# EAGLE design 226_grideye (EAGLE 8.2.2)
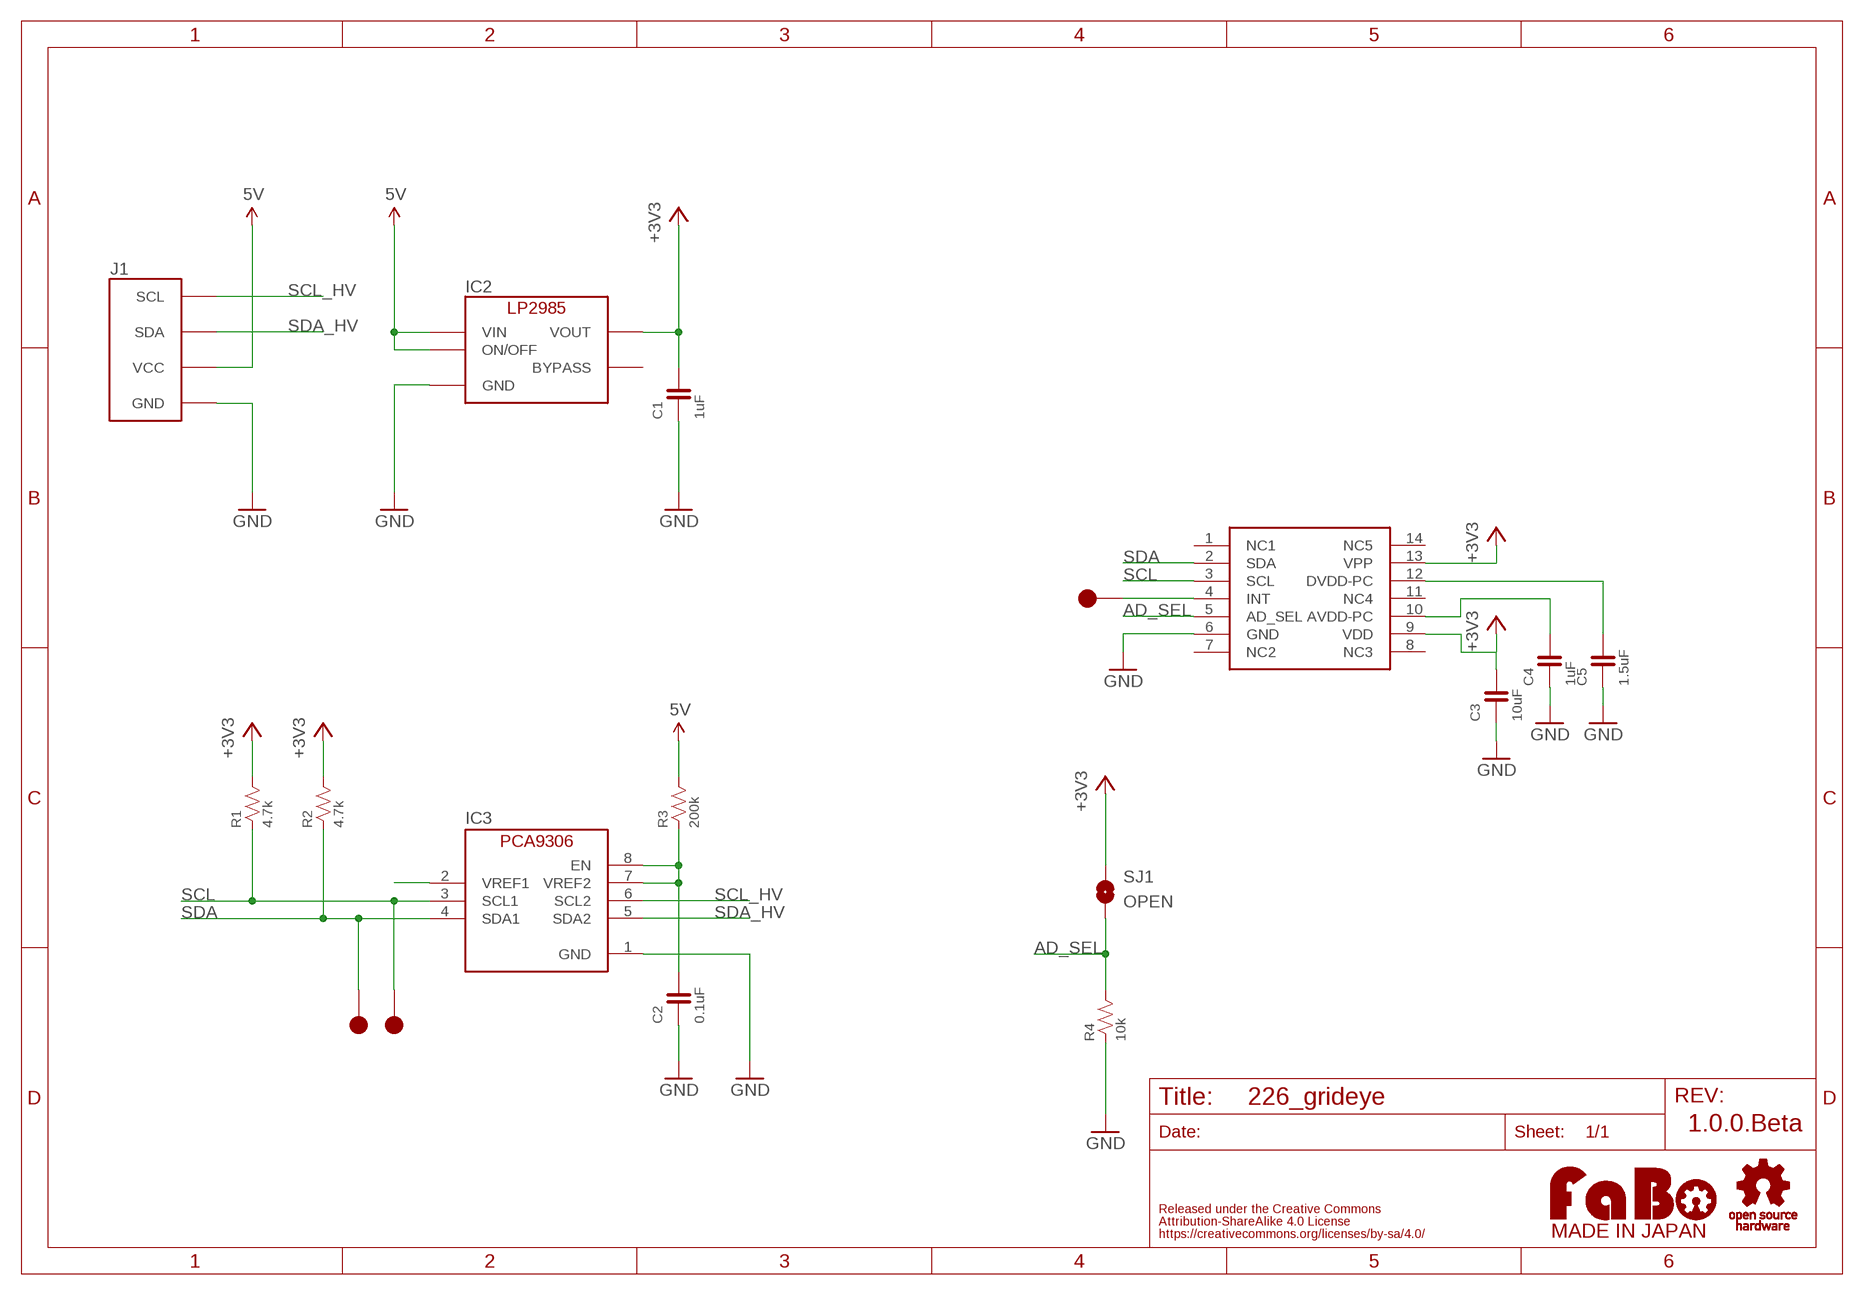
[diagram p0: schematic, sheet 1]

## Parts
C1  1uF  CAPACITOR-0603  [0603]
C2  0.1uF  CAPACITOR-0603  [0603]
C3  10uF  CAPACITOR-0603  [0603]
C4  1uF  CAPACITOR-0603  [0603]
C5  1.5uF  CAPACITOR-0603  [0603]
GRIDEYE  PN-AMG8331  [PANASONIC-AMG8831]
IC2  LP2985-33DBV  [SOT-23-5]
IC3  PCA9306GM  [XQFN8]
INT  INT  TP-15  [TP-15]
J1  FABO_BRICK_I2C  [FABO_BRICK_I2C]
R1  4.7k  RESISTOR-0603  [0603]
R2  4.7k  RESISTOR-0603  [0603]
R3  200k  RESISTOR-0603  [0603]
R4  10k  RESISTOR-0603  [0603]
SJ1  OPEN  SMD-JUMPER-2-OPEN  [SMD-JUMPER-2-OPEN]
TP1  TP-15  [TP-15]
TP2  TP-15  [TP-15]
U$2  LOGO_OSHW-M_BOTTOM  [LOGO_OSHW_M_BOTTOM]
U$3  LOGO_FABO-M  [LOGO_FABO_MS]

## Nets
5V: IC2.1(VIN) IC2.3(ON/OFF) J1.VCC R3.2
+3V3: C1.2 C3.2 GRIDEYE.9(VDD) GRIDEYE.13(VPP) IC2.5(VOUT) R1.2 R2.2 SJ1.1
AD_SEL: GRIDEYE.5(AD_SEL) R4.2 SJ1.2
GND: C1.1 C2.1 C3.1 C4.1 C5.1 GRIDEYE.6(GND) IC2.2(GND) IC3.1(GND) J1.GND R4.1
N$1: C2.2 IC3.7(VREF2) IC3.8(EN) R3.1
N$2: GRIDEYE.4(INT) INT.1
N$3: IC3.2(VREF1)
N$5: C5.2 GRIDEYE.12(DVDD-PC)
N$6: C4.2 GRIDEYE.10(AVDD-PC)
SCL: GRIDEYE.3(SCL) IC3.3(SCL1) R1.1 TP2.1
SCL_HV: IC3.6(SCL2) J1.SCL
SDA: GRIDEYE.2(SDA) IC3.4(SDA1) R2.1 TP1.1
SDA_HV: IC3.5(SDA2) J1.SDA
Unconnected: GRIDEYE.1(NC1) GRIDEYE.7(NC2) GRIDEYE.8(NC3) GRIDEYE.11(NC4) GRIDEYE.14(NC5) IC2.4(BYPASS)

## Notes on the sheet
- 1.0.0.Beta

## Library data of the parts
C1-C5 = FaBo-Capacitor:CAPACITOR: CAPACITOR
GRIDEYE = FaBo-Mems:PN-AMG8331
IC2 = FaBo-Supply:LP2985: LP2985
IC3 = FaBo-LevelTranslator:PCA9306
INT TP1 TP2 = FaBo-Supply:TP
J1 = FaBo-Template:FABO_BRICK_I2C: FaBo Brick I2C
R1-R4 = FaBo-Resistors:RESISTOR: RESISTOR
SJ1 = FaBo-Supply:SMD-JUMPER-2
U$2 = FaBo-etc:LOGO_OSHW
U$3 = FaBo-etc:LOGO_FABO

## Board
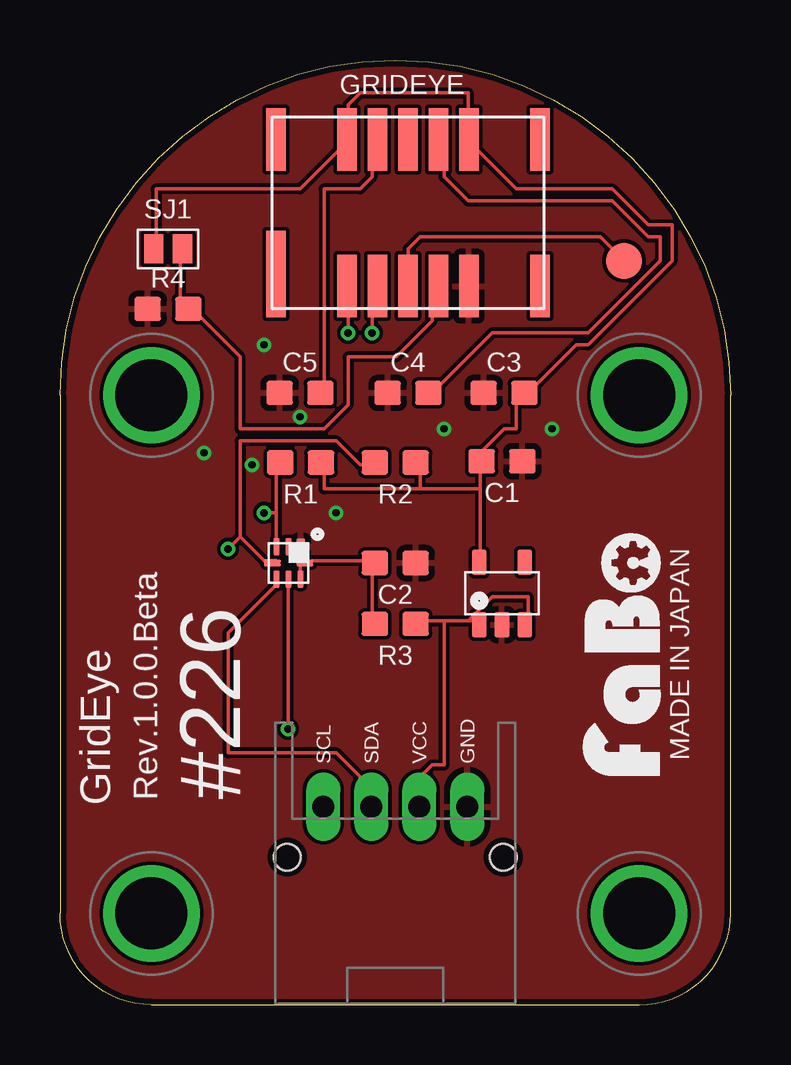
[diagram p1: board, top side]
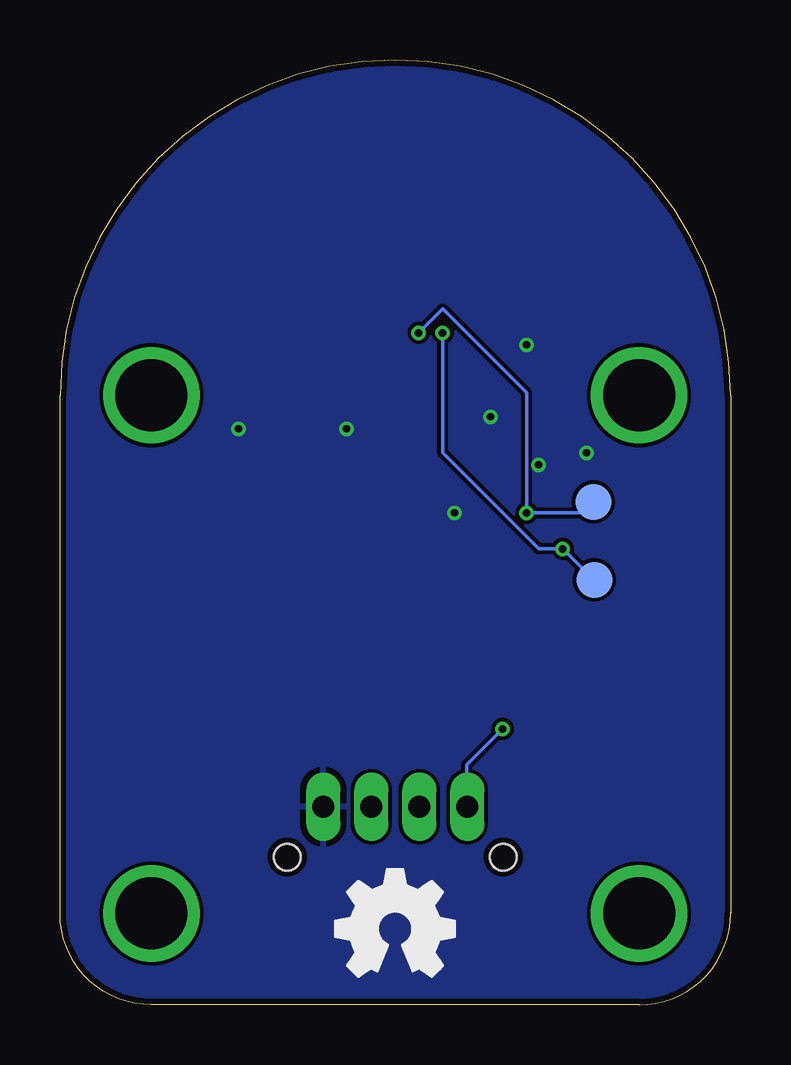
[diagram p2: board, bottom side, seen from below]

Size 27.94 x 39.37 mm. Coordinates in mm from the lower left corner, seen from the top.
Copper layers (1*16): Top 0.035mm / dielectric 1.5mm / Bottom 0.035mm
Design rules "SeeedStudio_2layer_DRU_no_angle_20140221": minimum track width 6mil, minimum drill 12mil, track to track 6mil, track to pad 6mil, pad to pad 6mil, via to via 6mil, smd to smd 0mil, copper to edge 10mil, drill to drill 10mil, minimum pad ring 10mil, minimum via ring 6mil, stop-mask expansion 2mil, vias tented up to drill 100mil, thermal gap 10mil

### Footprints (pad centres in the part's own frame; a part is rotated, then mirrored left to right if it is on the bottom)
0603 = smd 1.1 x 1: 1 -0.85,0; 2 0.85,0
PANASONIC-AMG8831 = smd 0.8 x 3.6: 1 -5.5,-2.55 | smd 0.8 x 2.6: 2 -2.54,-3.05; 3 -1.27,-3.05; 4 0,-3.05; 5 1.27,-3.05; 6 2.54,-3.05; 7 5.5,-3.05; 8 5.5,3.05; 9 2.54,3.05; 10 1.27,3.05; 11 0,3.05; 12 -1.27,3.05; 13 -2.54,3.05; 14 -5.5,3.05
SOT-23-5 = smd 0.6 x 1.05: 1 -0.95,-1.3; 2 0,-1.3; 3 0.95,-1.3; 4 0.95,1.3; 5 -0.95,1.3
XQFN8 = smd 0.7 x 0.35: 1 -0.675,0.5 | smd 0.7 x 0.25: 2 -0.675,0; 3 -0.675,-0.5; 5 0.675,-0.5; 6 0.675,0; 7 0.675,0.5 | smd 0.25 x 0.7: 4 0,-0.675; 8 0,0.675
TP-15 = smd 1.5 x 1.5: 1 0,0
FABO_BRICK_I2C = drill 0.9 pad 1.422 long: GND 3,-10.795; SCL -3,-10.795; SDA -1,-10.795; VCC 1,-10.795 | drill 3 pad 3.81: P$1 -10.16,6.35; P$2 10.16,6.35; P$3 -10.16,-15.24; P$4 10.16,-15.24 | hole 1.1: -4.5,-12.895; 4.5,-12.895
SMD-JUMPER-2-OPEN = smd 0.8 x 1.2: 1 -0.6,0; 2 0.6,0

### Placement (x,y rotation side)
C1  18.41,22.66 180 top
C2  13.97,18.41 180 top
C3  18.5,25.5 0 top
C4  14.5,25.5 0 top
C5  10,25.5 0 top
GRIDEYE  14.5,33 0 top
IC2  18.41,17.14 0 top
IC3  9.53,18.41 270 top
INT  23.5,31 0 top
J1  13.97,19.05 0 top
R1  10.03,22.59 0 top
R2  13.97,22.59 0 top
R3  13.97,15.88 0 top
R4  4.5,29 0 top
SJ1  4.5,31.5 0 top
TP1  5.67,17.7 0 bottom
TP2  5.71,20.95 0 bottom
U$2  13.97,3.17 0 top
U$3  25.4,14.61 90 top

### Tracks (layer width: path | path; a pad name or v marks a point on that pad's centre or on a via)
5V
  Top 0.152: 16,16 15,16 R3.2 | 16,16 17,16 | 17,16 17.5,16 IC2.1 | 17,16 18,17 19.5,17 19.5,16 IC2.3 | 16,16 16,10 15.5,10 15,9.5 15,8.5 J1.VCC
+3V3
  Top 0.152: 17.5,21.5 17.5,22.5 C1.2 17.5,23 18.5,24 19,24 19,25.5 C3.2 19.5,25.5 21.5,27.5 22,27.5 25.5,31 25.5,32.5 24.5,32.5 23,34 19,34 17,36 GRIDEYE.9 17,36.5 17,38 12.5,38 12,37.5 12,36.5 GRIDEYE.13 12,36 10,34 4,34 4,31.5 SJ1.1 | 17.5,21.5 17.5,18.5 IC2.5 | 17.5,21.5 15,21.5 | 15,21.5 11,21.5 11,22.5 R1.2 | 15,21.5 15,22.5 R2.2
AD_SEL
  Top 0.152: SJ1.2 5,31.5 5,29 R4.2 5.5,29 7.5,27 7.5,24 11,24 12,25 12,27 14,27 15.5,28.5 15.5,29.5 GRIDEYE.5
GND  (via drill 0.3)
  other vias: 20.5,24 16,24 6,23 10,24.5 8,22.5 11.5,20.5 8.5,27.5
  pour Bottom: 0,0 28,0 28,40 0,40
  pour Top: 0,0 28,0 28,40 0,40
N$1
  Top 0.152: IC3.7 10,18 10,18.5 IC3.8 10.5,18.5 13,18.5 C2.2 13,18 13,16 R3.1
N$2
  Top 0.152: INT.1 22.5,32 15,32 14.5,31.5 GRIDEYE.4
N$5
  Top 0.152: C5.2 11,25.5 11,34 12.5,34 13,34.5 13,36 GRIDEYE.12
N$6
  Top 0.152: C4.2 15.5,25.5 18,28 22,28 25,31 25,32 24.5,32 23,33.5 17,33.5 16,34.5 16,36 GRIDEYE.10
SCL  (via drill 0.3)
  Top 0.152: 9,20.5 9,22.5 R1.1 | 9,20.5 9,19 IC3.3 | 9,20.5 v8.5,20.5 | v13,28 13,29.5 GRIDEYE.3
  Bottom 0.152: TP2.1 6,20.5 v8.5,20.5 8.5,25.5 12,29 v13,28
SCL_HV  (via drill 0.3)
  Top 0.152: v9.5,11.5 9.5,17.5 IC3.6
  Bottom 0.152: v9.5,11.5 11,10 11,8.5 J1.SCL
SDA  (via drill 0.3)
  Top 0.152: 7.5,19.5 8.5,18.5 9,18.5 IC3.4 | 7.5,19.5 7.5,23.5 11.5,23.5 12.5,22.5 13,22.5 R2.1 | 7.5,19.5 v7,19 | v12,28 12,29.5 GRIDEYE.2
  Bottom 0.152: TP1.1 6,18 v7,19 8,19 12,23 v12,28
SDA_HV
  Top 0.152: IC3.5 9,17.5 7,15.5 7,10.5 11.5,10.5 12.5,9.5 12.5,8.5 J1.SDA

### Text on the board
tPlace: MADE IN JAPAN | #226 | Rev.1.0.0.Beta | GridEye